# EAGLE design SN754410 (EAGLE 6.5.0)
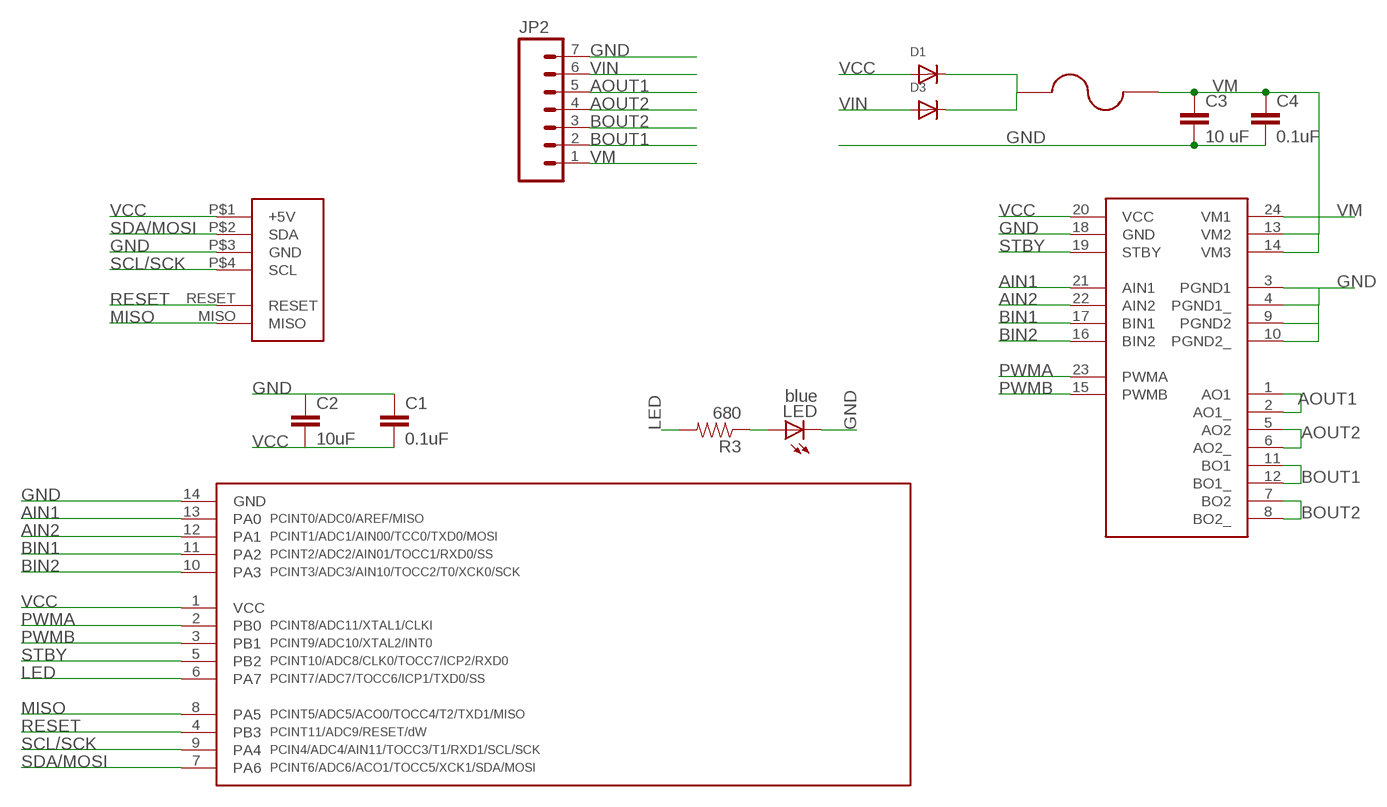
[diagram p0: schematic, sheet 1]

## Parts
C1  0.1uF  CAP0805  [0805]
C2  10uF  CAP0805  [0805]
C3  10 uF  CAP0805  [0805]
C4  0.1uF  CAP0805  [0805]
D1  DIODESOD-123  [SOD-123]
D3  DIODESOD-123  [SOD-123]
JP2  M07  [1X07]
LED  blue  LEDCHIPLED_1206  [CHIPLED_1206]
R3  680  RESISTOR0805-RES  [0805]
U$1  TB6612FNG  [SSOP-24]
U$2  FUSE  [1812]
U$3  TINY841  [SOIC14]
U$4  FOOTPRINT  [FOOTPRINT]

## Nets
AIN1: U$1.21(AIN1) U$3.13(PA0)
AIN2: U$1.22(AIN2) U$3.12(PA1)
AOUT1: JP2.5 U$1.1(AO1) U$1.2(AO1_)
AOUT2: JP2.4 U$1.5(AO2) U$1.6(AO2_)
BIN1: U$1.17(BIN1) U$3.11(PA2)
BIN2: U$1.16(BIN2) U$3.10(PA3)
BOUT1: JP2.2 U$1.11(BO1) U$1.12(BO1_)
BOUT2: JP2.3 U$1.7(BO2) U$1.8(BO2_)
GND: C1.1 C2.1 C3.2 C4.2 JP2.7 LED.C U$1.3(PGND1) U$1.4(PGND1_) U$1.9(PGND2) U$1.10(PGND2_) U$1.18(GND) U$3.14(GND) U$4.P$3(GND)
LED: R3.2 U$3.6(PA7)
MISO: U$3.8(PA5) U$4.MISO
N$1: D1.C D3.C U$2.P$1
N$5: LED.A R3.1
PWMA: U$1.23(PWMA) U$3.2(PB0)
PWMB: U$1.15(PWMB) U$3.3(PB1)
RESET: U$3.4(PB3) U$4.RESET
SCL/SCK: U$3.9(PA4) U$4.P$4(SCL)
SDA/MOSI: U$3.7(PA6) U$4.P$2(SDA)
STBY: U$1.19(STBY) U$3.5(PB2)
VCC: C1.2 C2.2 D1.A U$1.20(VCC) U$3.1(VCC) U$4.P$1(+5V)
VIN: D3.A JP2.6
VM: C3.1 C4.1 JP2.1 U$1.13(VM2) U$1.14(VM3) U$1.24(VM1) U$2.P$2

## Library data of the parts
C1-C4 = SparkFun-Capacitors:CAP: Capacitor Standard 0603 ceramic capacitor, and 0.1" leaded capacitor.
D1 D3 = adafruit:DIODE: Diode SMADIODE - SMA Surface Mount Package 20V 1A Schottky Diode Digikey: 641-1014-6-ND DO-1N4148 - Through Hole Small Current Diode SOD-123 20V 1 A (.5mV Vf) Schottky Diode - Digikey: MBRX120TPMSCT-ND SOD-323 10V 570mA (.38mV Vf, 3ns) Schottky Diode - Digikey: ZLLS410CT-ND SOD-523 30V 30mA Schottky Diode (RB751S-40TE61) - Digikey: RB751S-40TE61CT-ND SOT23-R/W - SOT23 Package (R = Solder Paste/Reflow Ovens, W = Hand-Soldering) BAT54Film 40V 300mA - Digikey: 497-7162-1-ND
JP2 = SparkFun-Connectors:M07: Header 7 Standard 7-pin 0.1" header. Use with straight break away headers (SKU : PRT-00116), right angle break away headers (PRT-00553), swiss pins (PRT-00743), machine pins (PRT-00117), and female headers (PRT-00115). NOTES ON THE VARIANTS LOCK and LOCK_LONGPADS... This footprint was designed to help hold the alignment of a through-hole component (i.e. 7-pin header) while soldering it into place. You may notice that each hole has been shifted either up or down by 0.005 of an inch from it's more standard position (which is usually a perfectly straight line). This slight alteration caused the pins (the squares in the middle) to touch the edges of the holes. Because they are alternating, it causes a "brace" to hold the header in place. 0.005 has proven to be the perfect amount of "off-center" position when using our standard breakaway headers. Although looks a little odd when you look at the bare footprint, once you have a header in there, the alteration is very hard to notice. Also, if you push a header all the way into place, it is covered up entirely on the bottom side. This idea of altering the position of holes to aid alignment will be further integrated into the Sparkfun Library for other footprints. It can help hold any component with 3 or more connection pins.
LED = led:LED: LED OSRAM: - CHIPLED LG R971, LG N971, LY N971, LG Q971, LY Q971, LO R971, LY R971 LH N974, LH R974 LS Q976, LO Q976, LY Q976 LO Q996 - Hyper CHIPLED LW Q18S LB Q993, LB Q99A, LB R99A - SideLED LS A670, LO A670, LY A670, LG A670, LP A670 LB A673, LV A673, LT A673, LW A673 LH A674 LY A675 LS A676, LA A676, LO A676, LY A676, LW A676 LS A679, LY A679, LG A679 - Hyper Micro SIDELED® LS Y876, LA Y876, LO Y876, LY Y876 LT Y87S - SmartLED LW L88C, LW L88S LB L89C, LB L89S, LG L890 LS L89K, LO L89K, LY L89K LS L896, LA L896, LO L896, LY L896 - TOPLED LS T670, LO T670, LY T670, LG T670, LP T670 LSG T670, LSP T670, LSY T670, LOP T670, LYG T670 LG T671, LOG T671, LSG T671 LB T673, LV T673, LT T673, LW T673 LH T674 LS T676, LA T676, LO T676, LY T676, LB T676, LH T676, LSB T676, LW T676 LB T67C, LV T67C, LT T67C, LS T67K, LO T67K, LY T67K, LW E67C LS E67B, LA E67B, LO E67B, LY E67B, LB E67C, LV E67C, LT E67C LW T67C LS T679, LY T679, LG T679 LS T770, LO T770, LY T770, LG T770, LP T770 LB T773, LV T773, LT T773, LW T773 LH T774 LS E675, LA E675, LY E675, LS T675 LS T776, LA T776, LO T776, LY T776, LB T776 LHGB T686 LT T68C, LB T68C - Hyper Mini TOPLED® LB M676 - Mini TOPLED Santana® LG M470 LS M47K, LO M47K, LY M47K Source: http://www.osram.convergy.de LUXEON: - LUMILED® LXK2-PW12-R00, LXK2-PW12-S00, LXK2-PW14-U00, LXK2-PW14-V00 LXK2-PM12-R00, LXK2-PM12-S00, LXK2-PM14-U00 LXK2-PE12-Q00, LXK2-PE12-R00, LXK2-PE12-S00, LXK2-PE14-T00, LXK2-PE14-U00 LXK2-PB12-K00, LXK2-PB12-L00, LXK2-PB12-M00, LXK2-PB14-N00, LXK2-PB14-P00, LXK2-PB14-Q00 LXK2-PR12-L00, LXK2-PR12-M00, LXK2-PR14-Q00, LXK2-PR14-R00 LXK2-PD12-Q00, LXK2-PD12-R00, LXK2-PD12-S00 LXK2-PH12-R00, LXK2-PH12-S00 LXK2-PL12-P00, LXK2-PL12-Q00, LXK2-PL12-R00 Source: www.luxeon.com KINGBRIGHT: KA-3528ASYC Source: www.kingbright.com
R3 = SparkFun-Passives:RESISTOR: Resistor Basic schematic elements and footprints for 0603, 1206, and PTH resistors.
U$1 = IntegerLabs:TB6612FNG
U$2 = IntegerLabs:FUSE
U$3 = IntegerLabs:TINY841
U$4 = IntegerLabs:FOOTPRINT

## Board
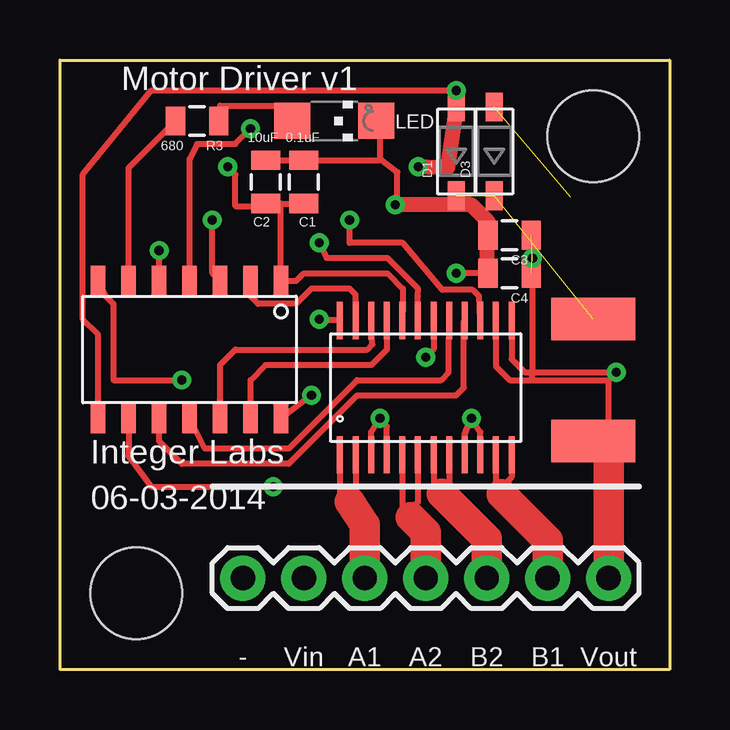
[diagram p1: board, top side]
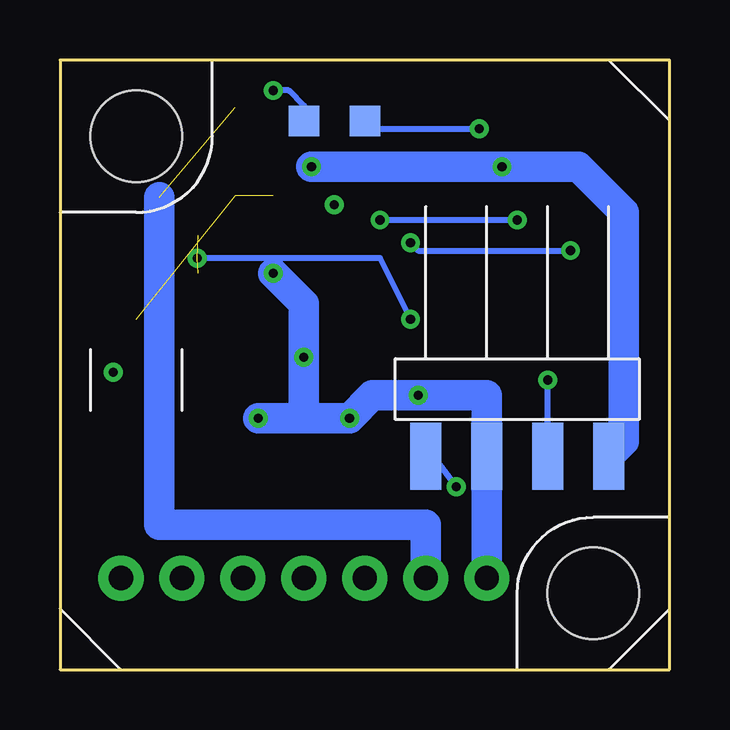
[diagram p2: board, bottom side, seen from below]

Size 25.4 x 25.4 mm. Coordinates in mm from the lower left corner, seen from the top.
Copper layers (1*16): Top 0.0178mm / dielectric 59mil / Bottom 0.0178mm
Design rules "SSC-EAGLE-2Lyr_v1.0.0.3": minimum track width 6mil, minimum drill 14mil, track to track 6mil, track to pad 6mil, pad to pad 6mil, via to via 6mil, smd to smd 6mil, copper to edge 20mil, drill to drill 16mil, minimum pad ring 8mil, minimum via ring 8mil, stop-mask expansion 3mil, vias tented up to drill 0mil, thermal gap 10mil

### Footprints (pad centres in the part's own frame; a part is rotated, then mirrored left to right if it is on the bottom)
0805 = smd 0.8 x 1.2: 1 -0.9,0; 2 0.9,0
SOD-123 = smd 1.2 x 0.7: A 1.85,0; C -1.85,0
1X07 = drill 1.016 pad 1.88: 1 0,0; 2 2.54,0; 3 5.08,0; 4 7.62,0; 5 10.16,0; 6 12.7,0; 7 15.24,0
CHIPLED_1206 = smd 1.5 x 1.5: A 0,-1.75; C 0,1.75
SSOP-24 = smd 0.25 x 1.55: 1 -3.575,-2.8; 2 -2.925,-2.8; 3 -2.275,-2.8; 4 -1.625,-2.8; 5 -0.975,-2.8; 6 -0.325,-2.8; 7 0.325,-2.8; 8 0.975,-2.8; 9 1.625,-2.8; 10 2.275,-2.8; 11 2.925,-2.8; 12 3.575,-2.8; 13 3.575,2.8; 14 2.925,2.8; 15 2.275,2.8; 16 1.625,2.8; 17 0.975,2.8; 18 0.325,2.8; 19 -0.325,2.8; 20 -0.975,2.8; 21 -1.625,2.8; 22 -2.275,2.8; 23 -2.925,2.8; 24 -3.575,2.8
1812 = smd 1.778 x 3.505: P$1 -2.54,0; P$2 2.54,0
SOIC14 = smd 0.61 x 1.27: 1 0,-3.175; 2 1.27,-3.175; 3 2.54,-3.175; 4 3.81,-3.175; 5 5.08,-3.175; 6 6.35,-3.175; 7 7.62,-3.175; 8 7.62,2.54; 9 6.35,2.54; 10 5.08,2.54; 11 3.81,2.54; 12 2.54,2.54; 13 1.27,2.54; 14 0,2.54
FOOTPRINT = smd 1.27 x 1.27 bottom: MISO 15.24,22.86; RESET 12.7,22.86 | smd 1.295 x 2.794 bottom: P$1 2.54,8.89; P$2 5.08,8.89; P$3 7.62,8.89; P$4 10.16,8.89 | hole 3.81: 22.225,22.225; 3.175,3.175

### Placement (x,y rotation side)
C1  10.16,20.32 270 top
C2  8.57,20.32 270 top
C3  18.73,18.1 180 top
C4  18.73,16.51 180 top
D1  16.51,21.59 90 top
D3  18.1,21.59 90 top
JP2  22.86,3.81 180 top
LED  11.43,22.86 270 top
R3  5.71,22.86 180 top
U$1  15.24,11.75 0 top
U$2  22.23,12.06 270 top
U$3  9.21,13.02 180 top
U$4  0,0 0 top

### Tracks (layer width: path | path; a pad name or v marks a point on that pad's centre or on a via)
AIN1
  Top 0.254: U$1.21 13.62,13.34 12.98,12.7 8.57,12.7 7.94,12.06 U$3.13
AIN2
  Top 0.254: U$1.22 12.96,14.23 13.02,13.55 12.8,13.34 7.3,13.34 6.67,12.7 U$3.12
AOUT1
  Top 0.254: U$1.1 11.66,7.38 11.91,7.14 | 11.91,7.14 12.06,6.99 | U$1.2 12.31,7.55 11.91,7.14
  Top 1.27: JP2.5 12.7,6.03 12.06,6.99
AOUT2
  Top 0.254: U$1.5 14.27,6.69 14.45,6.51 | 14.45,6.51 14.61,6.35 | U$1.6 14.91,6.98 14.45,6.51
  Top 1.27: JP2.4 15.24,5.71 14.61,6.35
BIN1
  Top 0.254: U$1.17 16.21,13.99 16.19,13.65 16.19,12.38 15.88,12.06 12.38,12.06 9.53,9.21 6.03,9.21 U$3.11
BIN2
  Top 0.254: U$3.10 4.13,9.53 5.08,8.57 9.53,8.57 12.38,11.43 16.51,11.43 16.83,11.75 16.83,14.51 U$1.16
BOUT1
  Top 0.254: U$1.11 18.16,7.55 18.26,7.46 | 18.26,7.46 18.41,7.3 | U$1.12 18.82,8.02 18.26,7.46
  Top 1.27: JP2.2 20.32,5.4 18.41,7.3
BOUT2
  Top 0.254: U$1.7 15.56,7.66 15.9,7.33 16.19,7.3 16.21,7.33 U$1.8
  Top 1.27: JP2.3 17.78,5.44 15.9,7.33
GND  (via drill 0.38)
  Top 0.254: U$3.14 v10.48,11.43 | 13.34,21.27 14.06,20.73 14.06,19.42 13.92,19.42 v13.97,19.37 | 13.34,21.27 13.34,22.7 LED.C | U$1.9 16.86,9.8 v17.14,10.48 17.52,9.89 U$1.10 | U$1.4 13.62,10.12 v13.34,10.48 12.96,9.89 U$1.3 | C2.1 C1.1 13.28,21.22 13.34,21.27 | U$1.18 15.56,13.34 v15.24,13.02 | C4.2 v16.51,16.51
  Top 0.635: C4.2 17.78,18.73 | 17.78,18.73 17.14,19.37 v13.97,19.37 | C3.2 17.83,18.68 17.78,18.73
  Bottom 0.254: U$4.P$3 7.62,9.84
  Bottom 1.27: 15.24,10.48 v13.34,10.48 12.38,11.43 v10.48,11.43 7.62,11.43 7.62,9.84 | 15.24,10.48 v17.14,10.48 | JP2.7 U$4.P$3 | 15.24,10.48 v15.24,13.02 15.24,15.24 v16.51,16.51
LED
  Top 0.254: U$3.6 2.86,20.9 R3.2
MISO  (via drill 0.38)
  Top 0.254: U$3.8 1.59,13.97 0.95,14.61 0.95,20.64 3.81,24.13 v16.51,24.13
  Bottom 0.254: U$4.MISO 15.24,23.5 15.88,24.13 v16.51,24.13
N$1  (2 unrouted)
N$5
  Top 0.254: R3.1 6.67,22.86 6.67,23.5 9.21,23.5 9.21,23.33 LED.A
PWMA
  Top 0.254: U$1.23 12.31,15.62 12.06,15.88 10.48,15.88 9.84,15.24 8.26,15.24 7.94,15.56 U$3.2
PWMB  (via drill 0.38)
  Top 0.254: U$1.15 17.46,15.56 17.2,15.82 15.93,15.82 14.29,17.78 12.06,17.78 v12.06,18.73 | U$3.3 6.35,16.51 v6.35,18.73
  Bottom 0.254: v6.35,18.73 v12.06,18.73
RESET  (via drill 0.38)
  Top 0.254: U$3.4 5.4,21.27 5.71,21.91 7.3,21.91 v7.94,22.54
  Bottom 0.254: U$4.RESET 12.7,22.54 v7.94,22.54
SCL/SCK  (via drill 0.38)
  Top 0.254: U$3.9 2.86,8.89 3.81,7.62 v8.89,7.62
  Bottom 0.254: U$4.P$4 9.84,8.89 v8.89,7.62
SDA/MOSI  (via drill 0.38)
  Top 0.254: U$3.7 1.91,15.56 2.22,15.24 2.22,12.06 v5.08,12.06
  Bottom 0.254: U$4.P$2 v5.08,12.06
STBY  (via drill 0.38)
  Top 0.254: U$1.19 14.91,15.56 14.92,15.87 13.65,17.14 11.11,17.14 v10.79,17.78 | U$3.5 v4.13,17.46
  Bottom 0.254: v10.79,17.78 10.48,17.46 v4.13,17.46
VCC  (via drill 0.38)
  Top 0.254: U$1.20 14.29,15.21 14.29,15.88 13.65,16.51 10.16,16.51 9.84,16.19 U$3.1 9.21,19.42 | 9.21,19.42 C2.2 8.47,19.32 7.3,19.32 7.3,20.64 v6.99,20.95 | 9.21,19.42 C1.2
  Top 0.635: D1.A 16.14,20.9 v14.92,20.95
  Bottom 1.27: v14.92,20.95 v6.99,20.95 3.81,20.95 1.91,19.05 1.91,9.53 U$4.P$1
VIN  (1 unrouted)
  Bottom 1.27: 21.27,19.68 21.27,6.03 10.16,6.03 JP2.6
VM  (via drill 0.38)  (2 unrouted)
  Top 0.254: U$1.13 18.82,12.94 19.37,12.38 19.68,12.38 | 19.68,12.38 v23.18,12.38 22.86,12.06 | U$1.14 18.16,12.63 18.73,12.06 19.68,12.06 | 19.68,12.06 22.86,12.06 | U$1.24 11.17,14.55 v10.79,14.61 | v19.68,17.14 19.68,12.38 | 19.68,12.06 19.68,12.38 | 22.86,9.53 22.86,12.06
  Top 1.27: JP2.1 22.86,9.53 U$2.P$2
  Bottom 0.254: v10.79,14.61 12.06,17.14 v19.68,17.14

### Text on the board
tPlace: Motor Driver v1 | Integer Labs | 06-03-2014
tNames: - | Vin | A1 | A2 | B2 | B1 | Vout